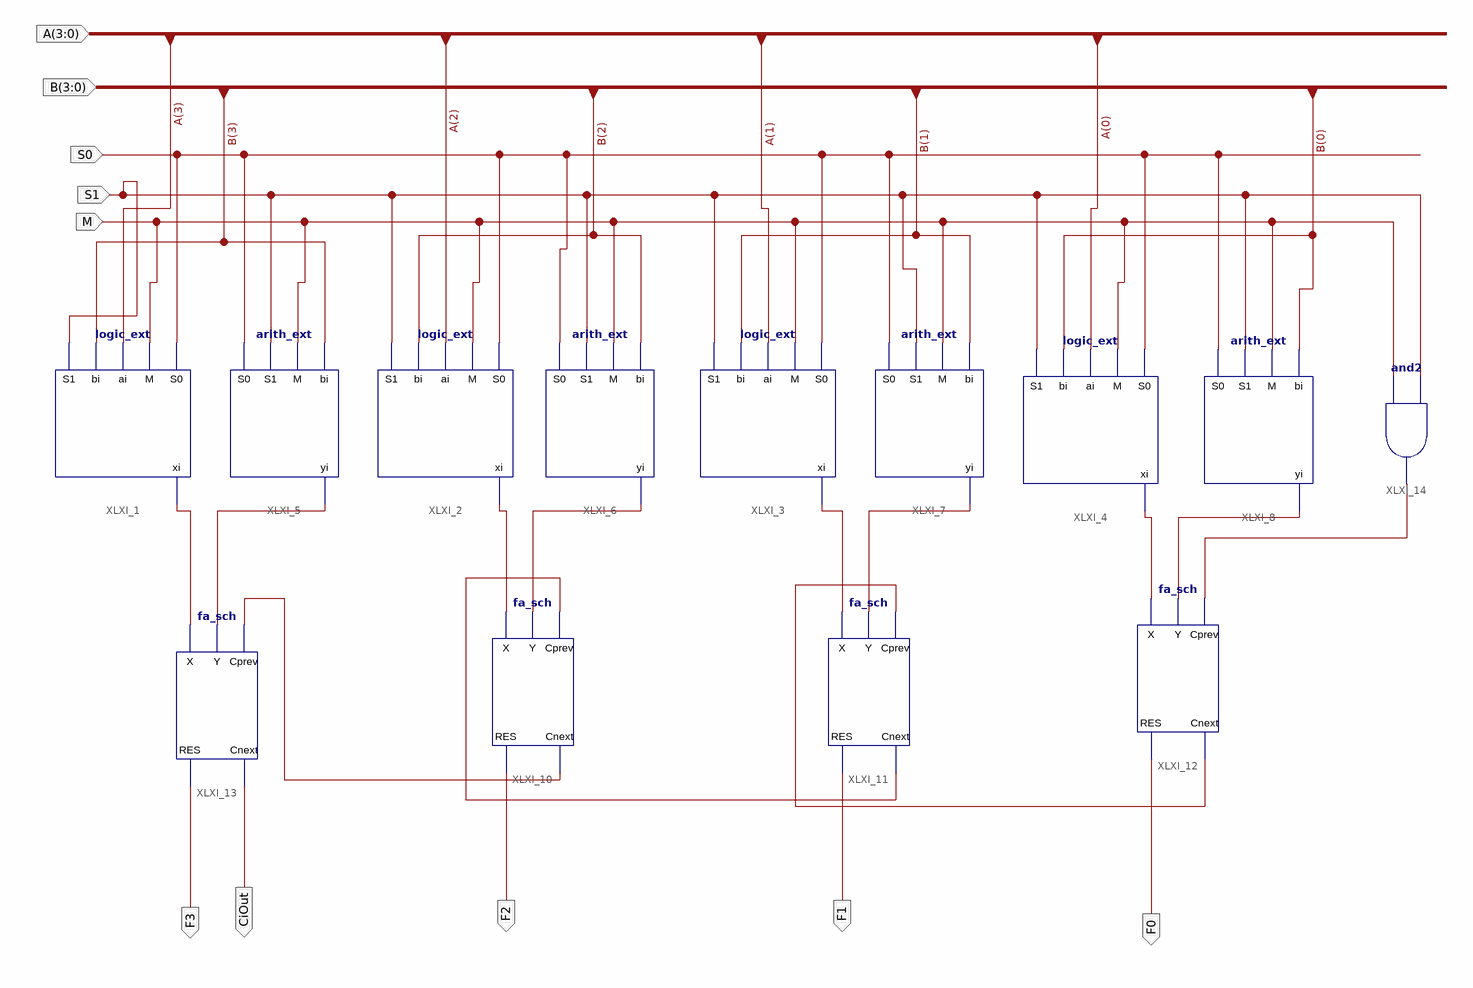
[diagram p0: schematic sheet 1]
// Xilinx ISE schematic alu4bit_sch.sch (spartan3e) as structural Verilog: 13 symbols, 10 ports
module alu4bit_sch (
  input  [3:0] A,
  input  [3:0] B,
  input  S0,
  input  S1,
  input  M,
  output CiOut,
  output F3,
  output F2,
  output F1,
  output F0
);

  wire XLXN_18, XLXN_19, XLXN_20, XLXN_21, XLXN_22, XLXN_23, XLXN_24, XLXN_25, XLXN_56, XLXN_57, XLXN_58,
       XLXN_59;

  logic_ext XLXI_1 (.S0(S0), .M(M), .ai(A[3]), .bi(B[3]), .S1(S1), .xi(XLXN_18));
  logic_ext XLXI_2 (.S0(S0), .M(M), .ai(A[2]), .bi(B[2]), .S1(S1), .xi(XLXN_20));
  logic_ext XLXI_3 (.S0(S0), .M(M), .ai(A[1]), .bi(B[1]), .S1(S1), .xi(XLXN_22));
  logic_ext XLXI_4 (.S0(S0), .M(M), .ai(A[0]), .bi(B[0]), .S1(S1), .xi(XLXN_24));
  arith_ext XLXI_5 (.bi(B[3]), .M(M), .S1(S1), .S0(S0), .yi(XLXN_19));
  arith_ext XLXI_6 (.bi(B[2]), .M(M), .S1(S1), .S0(S0), .yi(XLXN_21));
  arith_ext XLXI_7 (.bi(B[1]), .M(M), .S1(S1), .S0(S0), .yi(XLXN_23));
  arith_ext XLXI_8 (.bi(B[0]), .M(M), .S1(S1), .S0(S0), .yi(XLXN_25));
  fa_sch XLXI_10 (.Cprev(XLXN_58), .Y(XLXN_21), .X(XLXN_20), .Cnext(XLXN_59), .RES(F2));
  fa_sch XLXI_11 (.Cprev(XLXN_57), .Y(XLXN_23), .X(XLXN_22), .Cnext(XLXN_58), .RES(F1));
  fa_sch XLXI_12 (.Cprev(XLXN_56), .Y(XLXN_25), .X(XLXN_24), .Cnext(XLXN_57), .RES(F0));
  fa_sch XLXI_13 (.Cprev(XLXN_59), .Y(XLXN_19), .X(XLXN_18), .Cnext(CiOut), .RES(F3));
  and XLXI_14 (XLXN_56, M, S1);
endmodule
